# EAGLE design Transponder_LED (EAGLE 6.1)
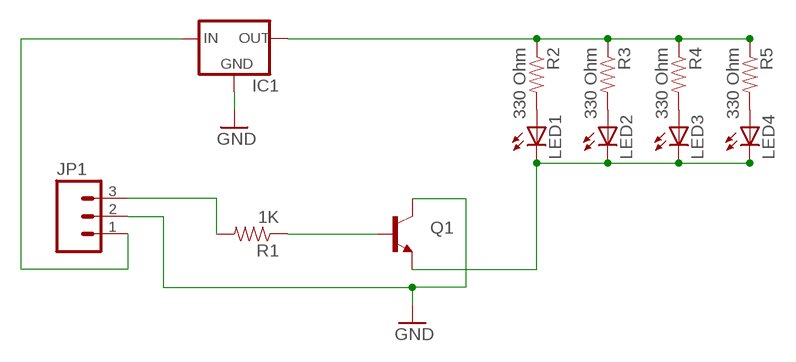
[diagram p0: schematic, sheet 1]

## Parts
IC1  V_REG_78XXTO-92  [TO-92]
JP1  M03JST-PTH  [JST-3-PTH]
LED1  LED5MM  [LED5MM]
LED2  LED5MM  [LED5MM]
LED3  LED5MM  [LED5MM]
LED4  LED5MM  [LED5MM]
Q1  TRANSISTOR_NPNTO92  [TO-92]
R1  1K  RESISTORPTH-1/4W  [AXIAL-0.4]
R2  330 Ohm  RESISTORPTH-1/4W  [AXIAL-0.4]
R3  330 Ohm  RESISTORPTH-1/4W  [AXIAL-0.4]
R4  330 Ohm  RESISTORPTH-1/4W  [AXIAL-0.4]
R5  330 Ohm  RESISTORPTH-1/4W  [AXIAL-0.4]

## Nets
GND: IC1.1(GND) JP1.2 Q1.3(C)
N$1: IC1.2(IN) JP1.1
N$2: Q1.2(B) R1.P$1
N$3: JP1.3 R1.P$2
N$4: LED1.A R2.P$2
N$5: LED2.A R3.P$2
N$6: LED3.A R4.P$2
N$7: LED4.A R5.P$2
N$8: IC1.3(OUT) R2.P$1 R3.P$1 R4.P$1 R5.P$1
N$9: LED1.K(C) LED2.K(C) LED3.K(C) LED4.K(C) Q1.1(E)

## Library data of the parts
IC1 = SparkFun:V_REG_78XX: Voltage Regulator Standard 7805 5V regulator. IGO (Input Ground Output). Spark Fun Electronics SKU : COM-00107
JP1 = SparkFun:M03: Header 3 Standard 3-pin 0.1" header. Use with straight break away headers (SKU : PRT-00116), right angle break away headers (PRT-00553), swiss pins (PRT-00743), machine pins (PRT-00117), and female headers (PRT-00115). Molex polarized connector foot print use with SKU : PRT-08232 with associated crimp pins and housings.
LED1-LED4 = SparkFun:LED: LEDs Standard schematic elements and footprints for 5mm, 3mm, 1206, and 0603 sized LEDs. 5mm - Spark Fun Electronics SKU : COM-00529 (and others)
Q1 = SparkFun:TRANSISTOR_NPN: Transistor NPN BJT configuration in SOT23 package. MMBT2222 is the common NPN we use. Double check BCE configuration again layout.
R1-R5 = SparkFun:RESISTOR: Resistor Basic schematic elements and footprints for 0603, 1206, and PTH resistors.

## Board
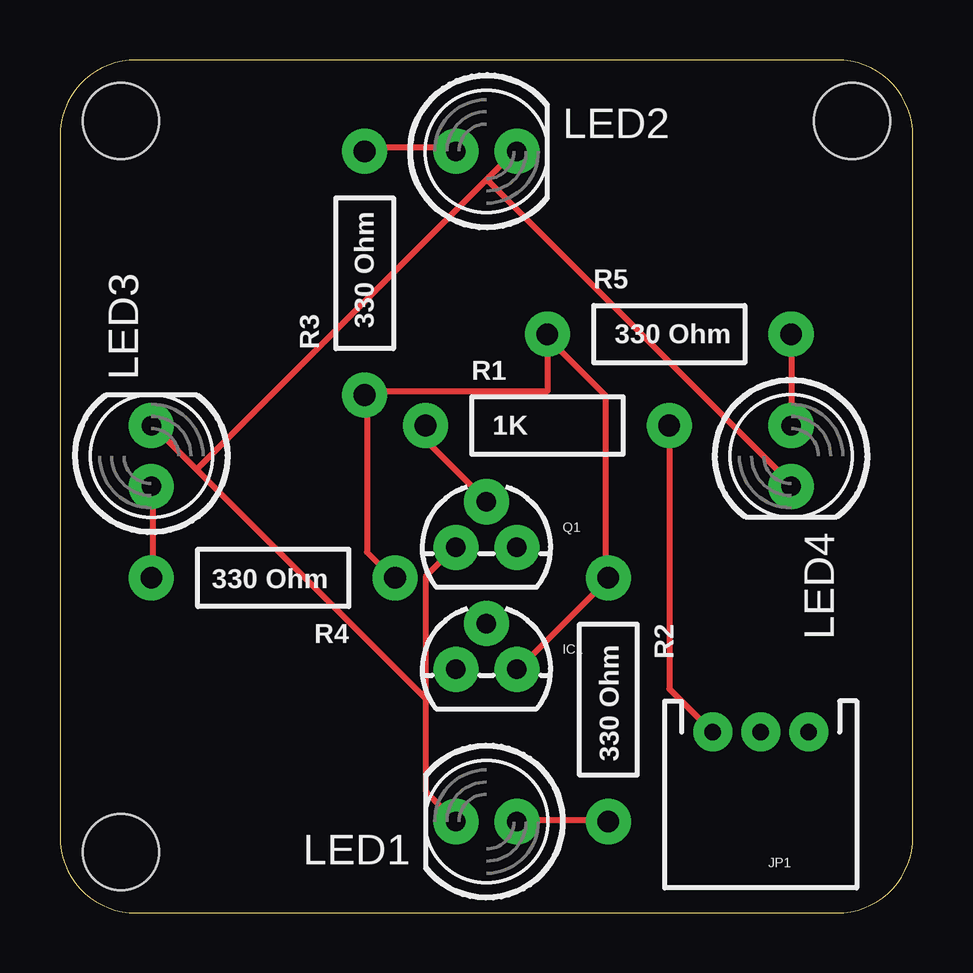
[diagram p1: board, top side]
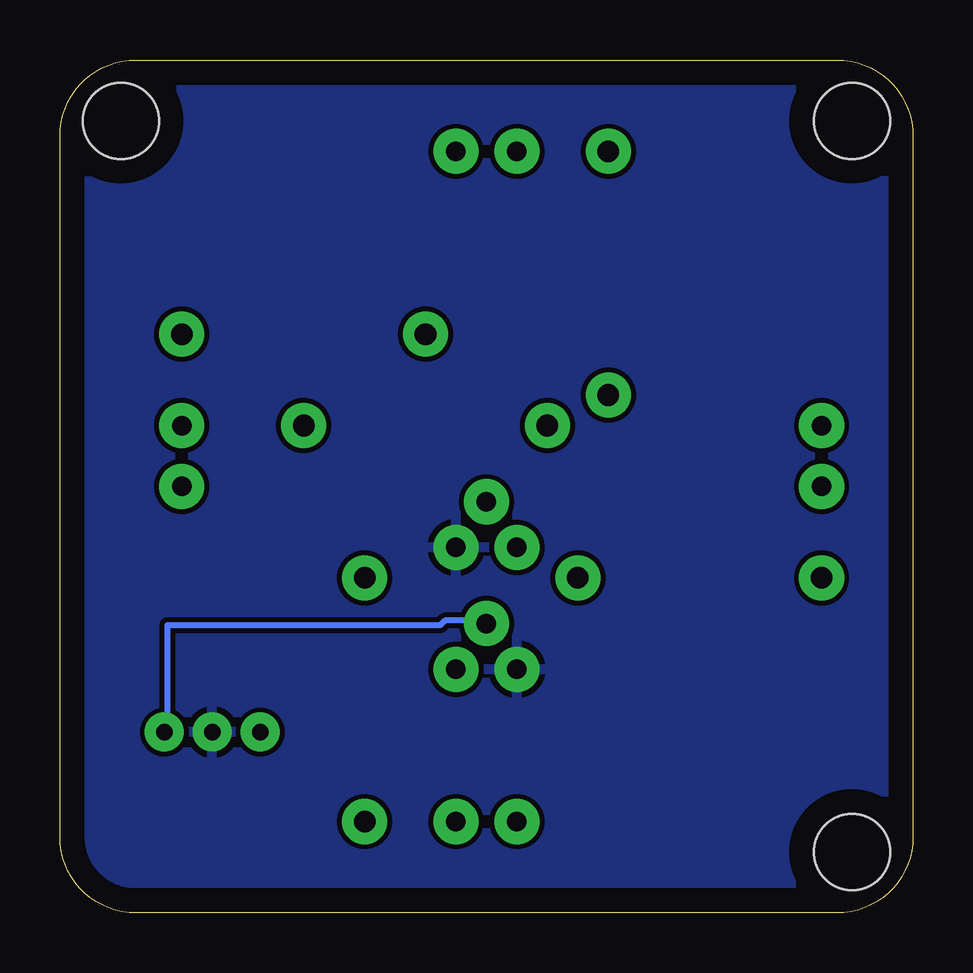
[diagram p2: board, bottom side, seen from below]

Size 35.56 x 35.56 mm. Coordinates in mm from the lower left corner, seen from the top.
Outline: 0,32.38 0,3.17 arc90 3.17,0 32.38,0 arc90 35.56,3.17 35.56,32.38 arc90 32.38,35.56 3.17,35.56 arc90 0,32.38
Copper layers (1*16): Top 0.035mm / dielectric 1.5mm / Bottom 0.035mm
Design rules: minimum track width 10mil, minimum drill 24mil, track to track 8mil, track to pad 8mil, pad to pad 8mil, via to via 8mil, smd to smd 8mil, copper to edge 40mil, drill to drill 8mil, minimum pad ring 10mil, minimum via ring 8mil, stop-mask expansion 4mil, vias tented up to drill 0mil, thermal gap 10mil
Holes 3.17 mm at 2.54,33.02 33.02,33.02 2.54,2.54

### Footprints (pad centres in the part's own frame; a part is rotated, then mirrored left to right if it is on the bottom)
TO-92 = drill 0.813 pad 1.88: 1 -1.27,0; 2 0,1.905; 3 1.27,0
JST-3-PTH = drill 0.7 pad 1.626: 1 -2,-5; 2 0,-5; 3 2,-5
LED5MM = drill 0.813 pad 1.88: A -1.27,0; K 1.27,0
AXIAL-0.4 = drill 0.9 pad 1.88: P$1 -5.08,0; P$2 5.08,0

### Placement (x,y rotation side)
IC1  17.78,10.16 0 top
JP1  29.21,2.54 180 top
LED1  17.78,3.81 180 top
LED2  17.78,31.75 0 top
LED3  3.81,19.05 90 top
LED4  30.48,19.05 270 top
Q1  17.78,15.24 0 top
R1  20.32,20.32 0 top
R2  22.86,8.89 270 top
R3  12.7,26.67 90 top
R4  8.89,13.97 180 top
R5  25.4,24.13 0 top

### Tracks (layer width: path | path; a pad name or v marks a point on that pad's centre or on a via)
GND
  pour Bottom: 0,35.56 35.56,35.56 35.56,0 0,0
N$1
  Bottom 0.254: JP1.1 31.09,7.72 31.09,11.99 19.71,11.99 19.51,12.19 17.88,12.19 IC1.2
N$2
  Top 0.254: R1.P$1 15.24,19.71 17.68,17.27 Q1.2
N$3
  Top 0.254: R1.P$2 25.4,9.35 27.03,7.72 JP1.3
N$4
  Top 0.254: LED1.A 19.1,3.86 22.76,3.86 R2.P$2
N$5
  Top 0.254: R3.P$2 12.8,31.9 16.46,31.9 LED2.A
N$6
  Top 0.254: R4.P$2 3.86,14.02 3.86,17.68 LED3.A
N$7
  Top 0.254: R5.P$2 LED4.A
N$8
  Top 0.254: R4.P$1 13.82,14.02 12.8,15.04 12.8,21.54 R3.P$1 12.8,21.74 20.32,21.74 20.32,23.98 | IC1.3 19.1,10.16 22.76,13.82 R2.P$1 22.76,14.02 22.76,21.54 20.32,23.98 | 20.32,23.98 R5.P$1
N$9
  Top 0.254: LED1.K 15.24,5.08 15.24,8.94 | 15.24,8.94 15.24,14.02 16.46,15.24 Q1.1 | 15.24,8.94 5.69,18.49 | 5.69,18.49 3.86,20.32 LED3.K | 5.69,18.49 17.88,30.68 | 17.88,30.68 18.9,31.7 LED2.K | 17.88,30.68 17.88,30.48 30.48,17.88 LED4.K